# EAGLE schematic V1 (EAGLE 6.5.0)
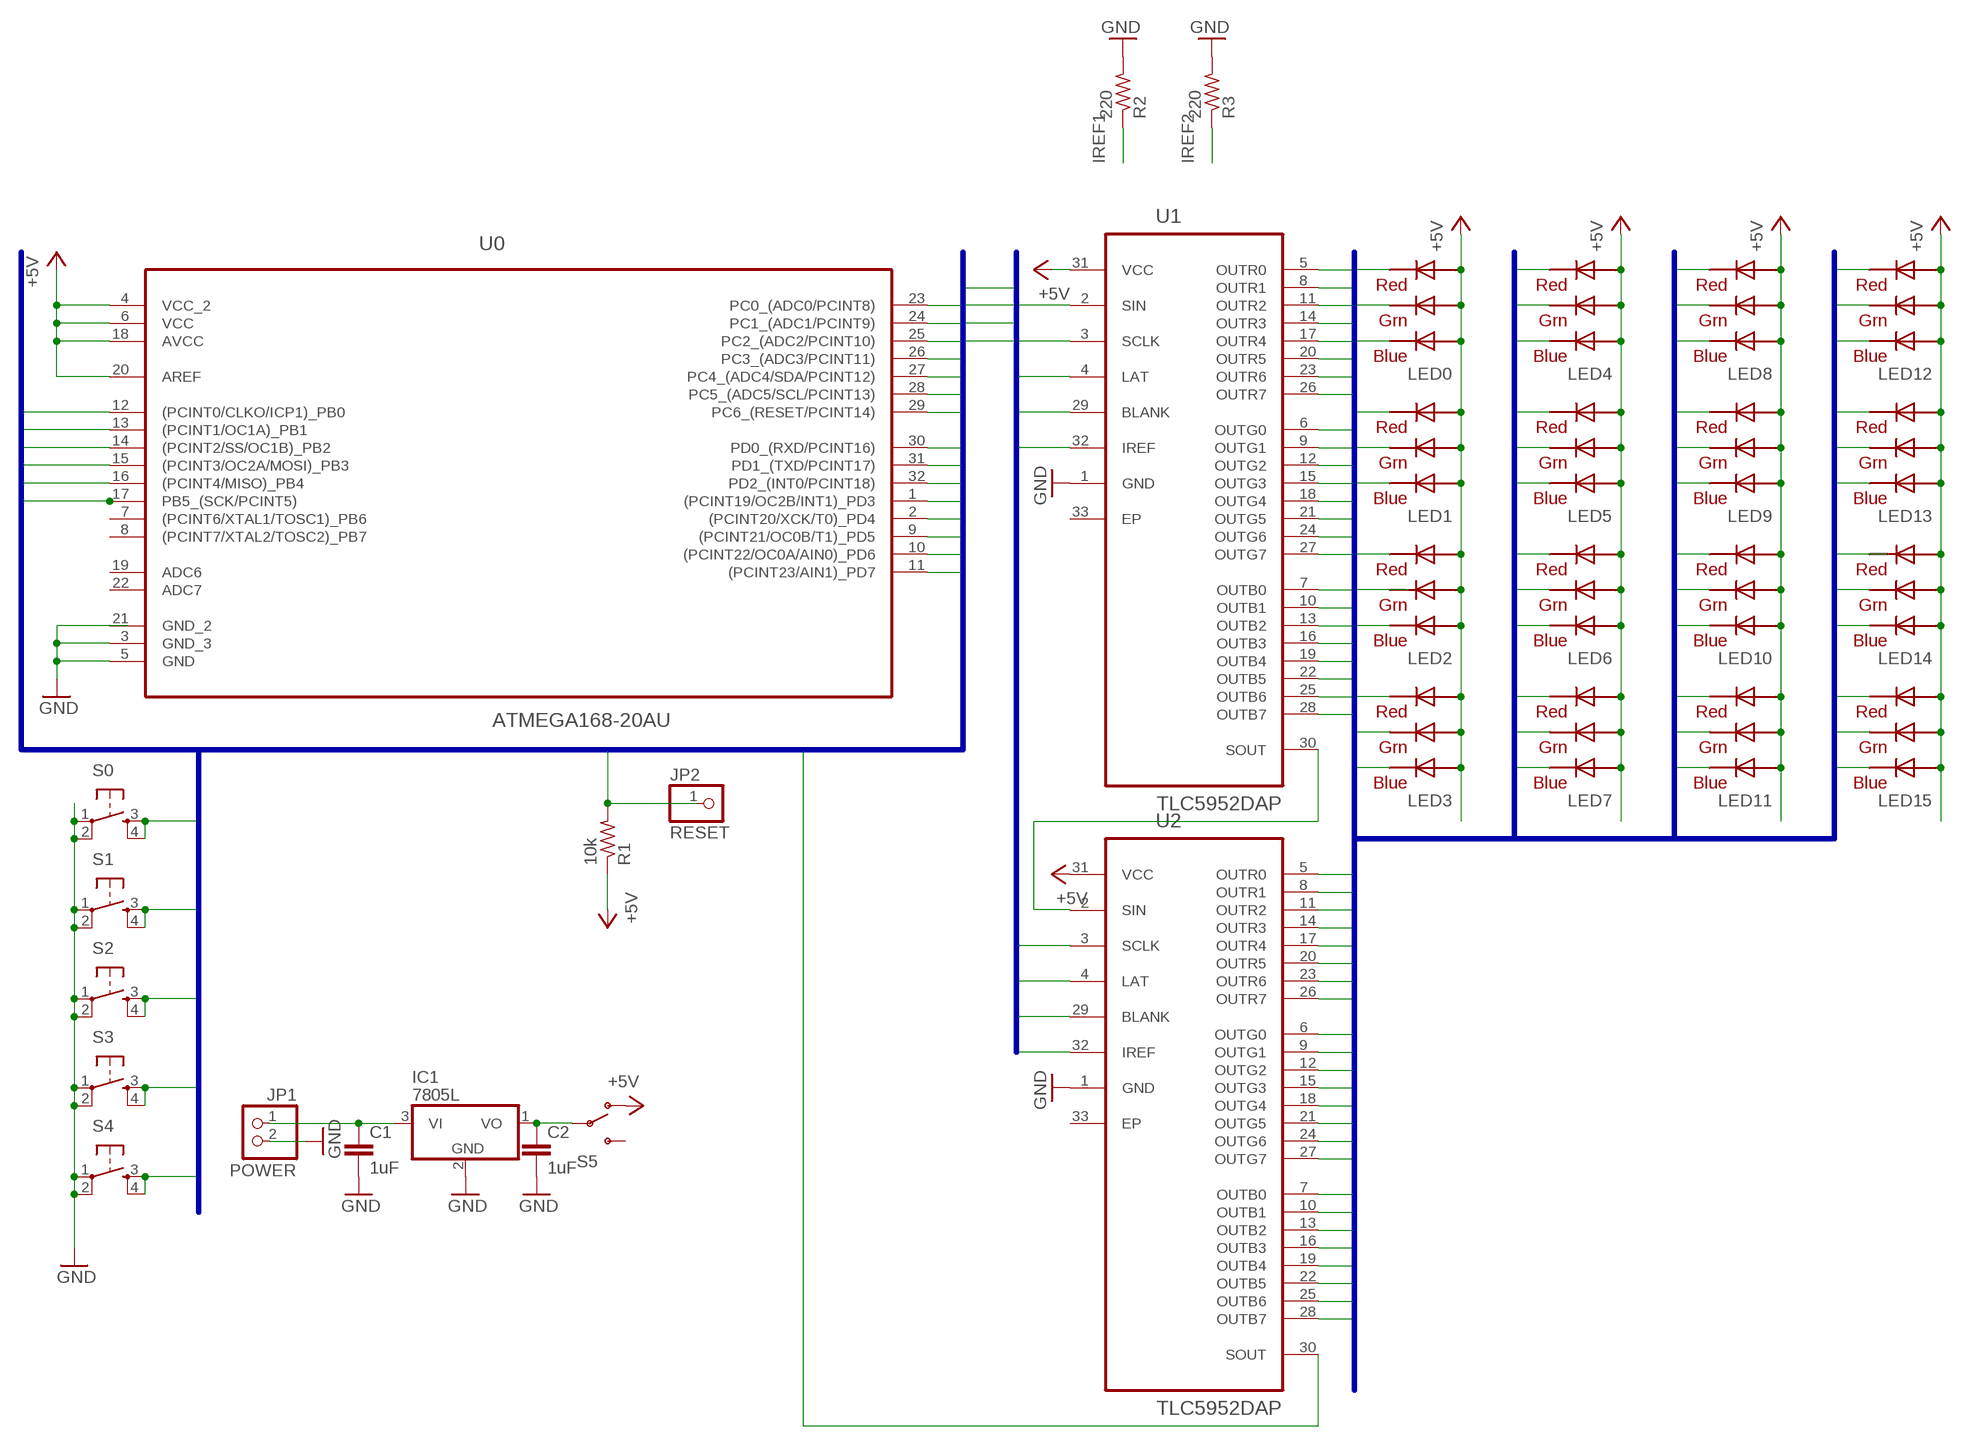
[diagram p0: schematic, sheet 1]

## Parts
C1  1uF  C2,5-3  [C2.5-3]
C2  1uF  C2,5-3  [C2.5-3]
IC1  7805L  [TO92]
JP1  POWER  PINHD-1X2  [1X02]
JP2  RESET  PINHD-1X1  [1X01]
LED0  RGBLED5050  [RGBLED5050]
LED1  RGBLED5050  [RGBLED5050]
LED2  RGBLED5050  [RGBLED5050]
LED3  RGBLED5050  [RGBLED5050]
LED4  RGBLED5050  [RGBLED5050]
LED5  RGBLED5050  [RGBLED5050]
LED6  RGBLED5050  [RGBLED5050]
LED7  RGBLED5050  [RGBLED5050]
LED8  RGBLED5050  [RGBLED5050]
LED9  RGBLED5050  [RGBLED5050]
LED10  RGBLED5050  [RGBLED5050]
LED11  RGBLED5050  [RGBLED5050]
LED12  RGBLED5050  [RGBLED5050]
LED13  RGBLED5050  [RGBLED5050]
LED14  RGBLED5050  [RGBLED5050]
LED15  RGBLED5050  [RGBLED5050]
R1  10k  R-US_0207/10  [0207/10]
R2  220  R-US_0207/10  [0207/10]
R3  220  R-US_0207/10  [0207/10]
S0  TAC_SWITCHPTH  [TACTILE-PTH]
S1  TAC_SWITCHPTH  [TACTILE-PTH]
S2  TAC_SWITCHPTH  [TACTILE-PTH]
S3  TAC_SWITCHPTH  [TACTILE-PTH]
S4  TAC_SWITCHPTH  [TACTILE-PTH]
S5  SWITCH-SPDTPTH  [SWITCH-SPDT]
U0  ATMEGA168-20AU  [QFP80P900X900X120-32N]
U1  TLC5952DAP  [SOP65P810X120-33N]
U2  TLC5952DAP  [SOP65P810X120-33N]

## Nets
+5V: LED0.1(GREEN_A) LED0.2(RED_A) LED0.3(BLUE_A) LED1.1(GREEN_A) LED1.2(RED_A) LED1.3(BLUE_A) LED2.1(GREEN_A) LED2.2(RED_A) LED2.3(BLUE_A) LED3.1(GREEN_A) LED3.2(RED_A) LED3.3(BLUE_A) LED4.1(GREEN_A) LED4.2(RED_A) LED4.3(BLUE_A) LED5.1(GREEN_A) LED5.2(RED_A) LED5.3(BLUE_A) LED6.1(GREEN_A) LED6.2(RED_A) LED6.3(BLUE_A) LED7.1(GREEN_A) LED7.2(RED_A) LED7.3(BLUE_A) LED8.1(GREEN_A) LED8.2(RED_A) LED8.3(BLUE_A) LED9.1(GREEN_A) LED9.2(RED_A) LED9.3(BLUE_A) LED10.1(GREEN_A) LED10.2(RED_A) LED10.3(BLUE_A) LED11.1(GREEN_A) LED11.2(RED_A) LED11.3(BLUE_A) LED12.1(GREEN_A) LED12.2(RED_A) LED12.3(BLUE_A) LED13.1(GREEN_A) LED13.2(RED_A) LED13.3(BLUE_A) LED14.1(GREEN_A) LED14.2(RED_A) LED14.3(BLUE_A) LED15.1(GREEN_A) LED15.2(RED_A) LED15.3(BLUE_A) R1.1 S5.1(O) U0.4(VCC_2) U0.6(VCC) U0.18(AVCC) U0.20(AREF) U1.31(VCC) U2.31(VCC)
ANALOG0: U0.23(PC0_(ADC0/PCINT8))
ANALOG1: U0.24(PC1_(ADC1/PCINT9))
ANALOG2: U0.25(PC2_(ADC2/PCINT10))
ANALOG3: U0.26(PC3_(ADC3/PCINT11))
ANALOG4: U0.27(PC4_(ADC4/SDA/PCINT12))
ANALOG5: U0.28(PC5_(ADC5/SCL/PCINT13))
CARRY: U1.30(SOUT) U2.2(SIN)
DIGITAL0: U0.30(PD0_(RXD/PCINT16))
DIGITAL1: U0.31(PD1_(TXD/PCINT17))
DIGITAL2: S1.3 S1.4 U0.32(PD2_(INT0/PCINT18))
DIGITAL3: U0.1((PCINT19/OC2B/INT1)_PD3) U1.2(SIN)
DIGITAL4: S2.3 S2.4 U0.2((PCINT20/XCK/T0)_PD4)
DIGITAL5: U0.9((PCINT21/OC0B/T1)_PD5) U1.3(SCLK) U2.3(SCLK)
DIGITAL6: U0.10((PCINT22/OC0A/AIN0)_PD6) U1.4(LAT) U2.4(LAT)
DIGITAL7: S3.3 S3.4 U0.11((PCINT23/AIN1)_PD7)
DIGITAL8: S4.3 S4.4 U0.12((PCINT0/CLKO/ICP1)_PB0)
DIGITAL9: U0.13((PCINT1/OC1A)_PB1) U1.29(BLANK) U2.29(BLANK)
DIGITAL10: U0.14((PCINT2/SS/OC1B)_PB2) U2.30(SOUT)
DIGITAL11: U0.15((PCINT3/OC2A/MOSI)_PB3)
DIGITAL12: S0.3 S0.4 U0.16((PCINT4/MISO)_PB4)
DIGITAL13: U0.17(PB5_(SCK/PCINT5))
GND: C1.2 C2.2 IC1.2(GND) JP1.2 R2.2 R3.2 S0.1 S0.2 S1.1 S1.2 S2.1 S2.2 S3.1 S3.2 S4.1 S4.2 U0.3(GND_3) U0.5(GND) U1.1(GND) U2.1(GND)
IREF1: R2.1 U1.32(IREF)
IREF2: R3.1 U2.32(IREF)
N$1: C2.1 IC1.1(VO) S5.2(P)
N$2: C1.1 IC1.3(VI) JP1.1
OUTB0: LED0.4(BLUE_C) U1.7(OUTB0)
OUTB1: LED1.4(BLUE_C) U1.10(OUTB1)
OUTB2: LED2.4(BLUE_C) U1.13(OUTB2)
OUTB3: LED3.4(BLUE_C) U1.16(OUTB3)
OUTB4: LED4.4(BLUE_C) U1.19(OUTB4)
OUTB5: LED5.4(BLUE_C) U1.22(OUTB5)
OUTB6: LED6.4(BLUE_C) U1.25(OUTB6)
OUTB7: LED7.4(BLUE_C) U1.28(OUTB7)
OUTB8: LED8.4(BLUE_C) U2.7(OUTB0)
OUTB9: LED9.4(BLUE_C) U2.10(OUTB1)
OUTB10: LED10.4(BLUE_C) U2.13(OUTB2)
OUTB11: LED11.4(BLUE_C) U2.16(OUTB3)
OUTB12: LED12.4(BLUE_C) U2.19(OUTB4)
OUTB13: LED13.4(BLUE_C) U2.22(OUTB5)
OUTB14: LED14.4(BLUE_C) U2.25(OUTB6)
OUTB15: LED15.4(BLUE_C) U2.28(OUTB7)
OUTG0: LED0.6(GREEN_C) U1.6(OUTG0)
OUTG1: LED1.6(GREEN_C) U1.9(OUTG1)
OUTG2: U1.12(OUTG2)
OUTG3: LED3.6(GREEN_C) U1.15(OUTG3)
OUTG4: LED4.6(GREEN_C) U1.18(OUTG4)
OUTG5: LED5.6(GREEN_C) U1.21(OUTG5)
OUTG6: LED6.6(GREEN_C) U1.24(OUTG6)
OUTG7: LED7.6(GREEN_C) U1.27(OUTG7)
OUTG8: LED8.6(GREEN_C) U2.6(OUTG0)
OUTG9: LED9.6(GREEN_C) U2.9(OUTG1)
OUTG10: LED10.6(GREEN_C) U2.12(OUTG2)
OUTG11: LED11.6(GREEN_C) U2.15(OUTG3)
OUTG12: LED12.6(GREEN_C) U2.18(OUTG4)
OUTG13: LED13.6(GREEN_C) U2.21(OUTG5)
OUTG14: LED14.6(GREEN_C) U2.24(OUTG6)
OUTG15: LED15.6(GREEN_C) U2.27(OUTG7)
OUTR0: LED0.5(RED_C) U1.5(OUTR0)
OUTR1: LED1.5(RED_C) U1.8(OUTR1)
OUTR2: LED2.5(RED_C) U1.11(OUTR2)
OUTR3: LED3.5(RED_C) U1.14(OUTR3)
OUTR4: LED4.5(RED_C) U1.17(OUTR4)
OUTR5: LED5.5(RED_C) U1.20(OUTR5)
OUTR6: LED6.5(RED_C) U1.23(OUTR6)
OUTR7: LED7.5(RED_C) U1.26(OUTR7)
OUTR8: LED8.5(RED_C) U2.5(OUTR0)
OUTR9: LED9.5(RED_C) U2.8(OUTR1)
OUTR10: LED10.5(RED_C) U2.11(OUTR2)
OUTR11: LED11.5(RED_C) U2.14(OUTR3)
OUTR12: LED12.5(RED_C) U2.17(OUTR4)
OUTR13: LED13.5(RED_C) U2.20(OUTR5)
OUTR14: U2.23(OUTR6)
OUTR15: LED15.5(RED_C) U2.26(OUTR7)
RESET: JP2.1 R1.2 U0.29(PC6_(RESET/PCINT14))
Unconnected: LED2.6(GREEN_C) LED14.5(RED_C) S5.3(S) U0.7((PCINT6/XTAL1/TOSC1)_PB6) U0.8((PCINT7/XTAL2/TOSC2)_PB7) U0.19(ADC6) U0.21(GND_2) U0.22(ADC7) U1.33(EP) U2.33(EP)

## Buses
DIGITAL3,DIGITAL5,DIGITAL6,DIGITAL9
OUTR[0..15],OUTG[0..15],OUTB[0..15]
DIGITAL[0..13],ANALOG[0..5],RESET

## Library data of the parts
C1 C2 = capacitor-wima:C: CAPACITOR naming: grid - package width
IC1 = linear:78*: Positive VOLTAGE REGULATOR Source: http://cache.national.com/ds/LM/LM78L05.pdf http://www.fairchildsemi.com/ds/LM/LM7805.pdf
JP1 = pinhead:PINHD-1X2: PIN HEADER
JP2 = pinhead:PINHD-1X1: PIN HEADER
LED0 LED1-LED15 = adafruit:RGBLED: For 5050 RGB LEDs, the order of the LEDs may vary from one manufacturer to another!
R1-R3 = resistor:R-US_: RESISTOR, American symbol
S0 S1-S4 = SparkFun-Electromechanical:TAC_SWITCH: Momentary Switch Button commonly used for reset or general input. Spark Fun Electronics SKU : COM-00097 SMT- SWCH-08247
S5 = SparkFun-Electromechanical:SWITCH-SPDT: SPDT Switch Simple slide switch, Spark Fun Electronics SKU : COM-00102 DPDT SMT slide switch, AYZ0202, SWCH-08179
U0 = atmega168:ATMEGA168-20AU: Microcontroller; MPN: ATMEGA168-20AU; OC_FARNELL: 9171193; OC_NEWARK: 68T2692; PACKAGE: QFP-32; SUPPLIER: ATMEL
U1 U2 = tlc5952DAP:TLC5952DAP: 24-Channel, Constant-Current LED Driver; MPN: TLC5952DAP; OC_FARNELL: 1755260; OC_NEWARK: 24R9993; PACKAGE: HTSSOP-32; SUPPLIER: Texas Instruments